# EAGLE schematic atmega_midi_SP0256-AL2 (EAGLE 7.6.0)
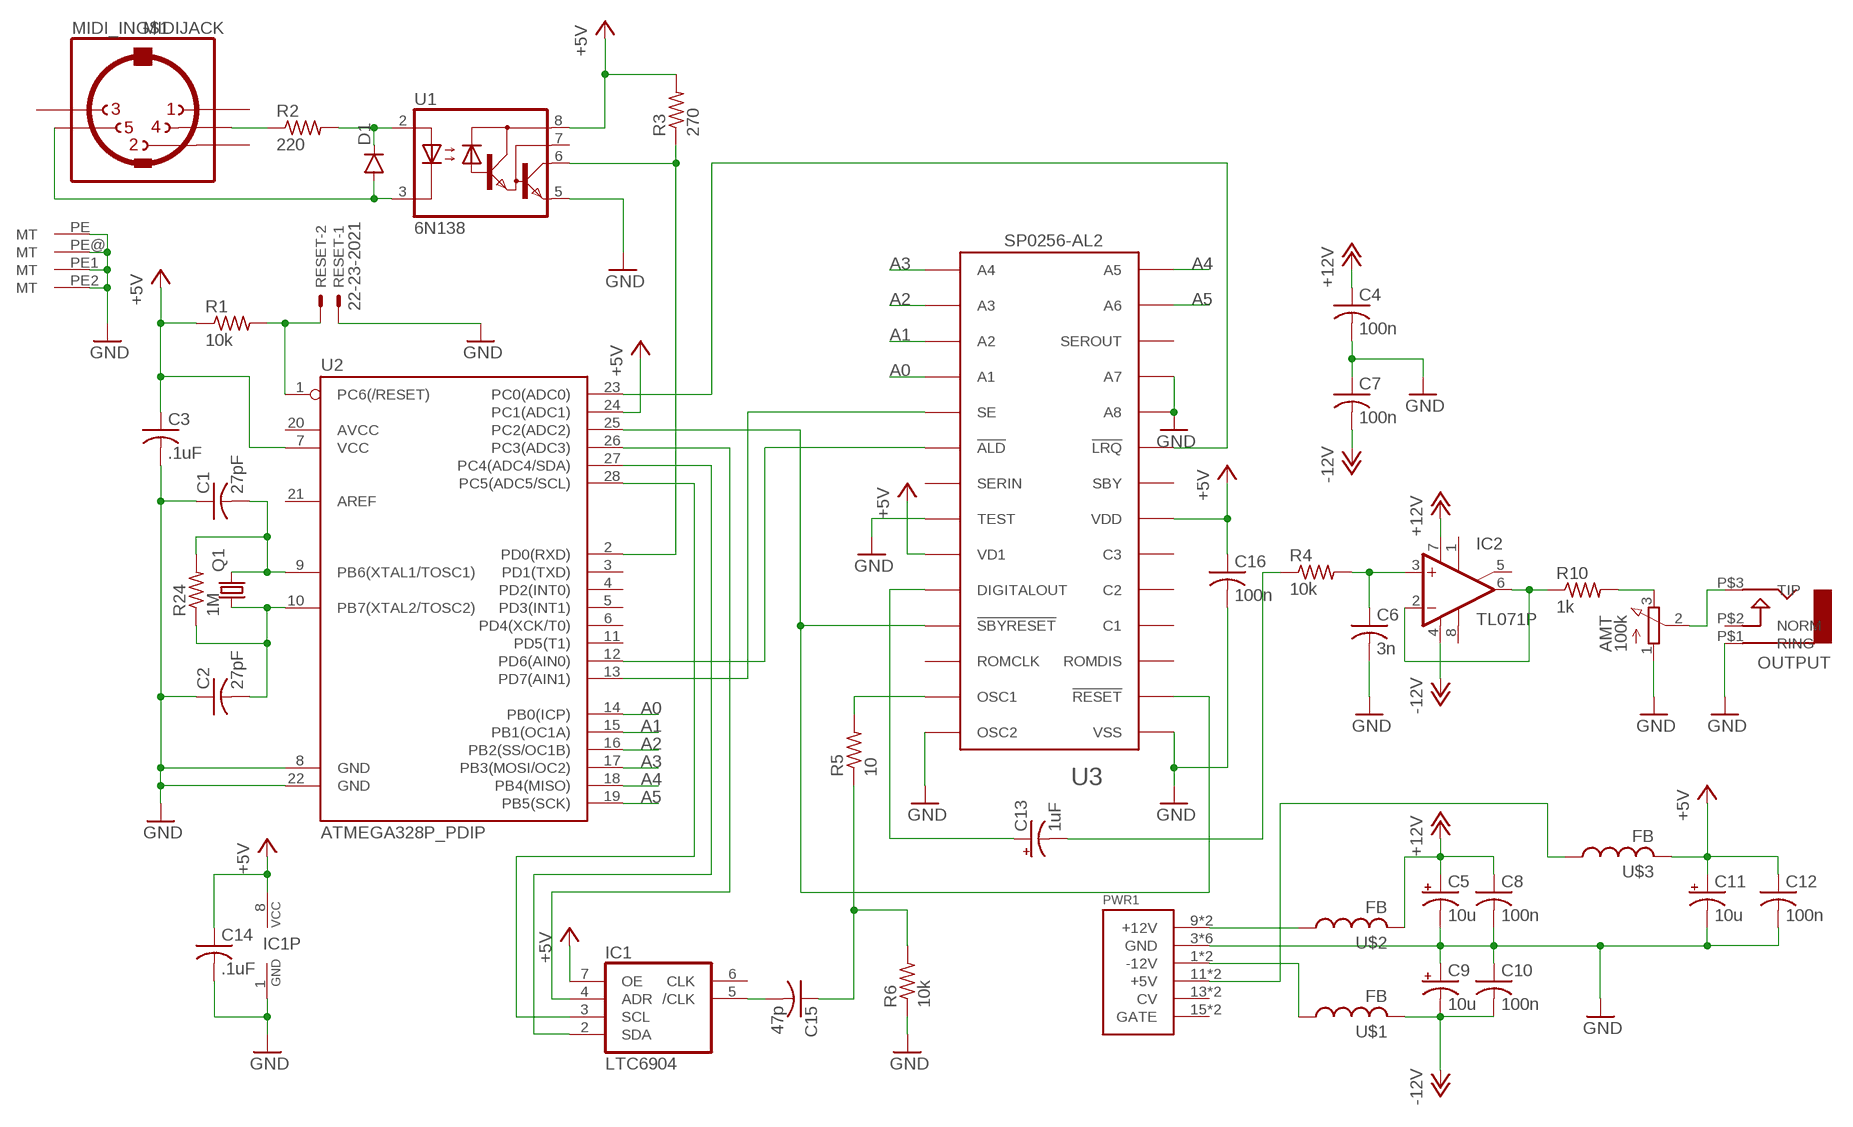
[diagram p0: schematic, sheet 1]

## Parts
AMT  100k  3RP/1610N  [3RP/1610N]
C1  27pF  C-US025-040X050  [C025-040X050]
C2  27pF  C-US025-040X050  [C025-040X050]
C3  .1uF  C-US025-030X050  [C025-030X050]
C4  100n  C-US050-024X044  [C050-024X044]
C5  10u  CPOL-USB45181A  [B45181A]
C6  3n  C-US050-024X044  [C050-024X044]
C7  100n  C-US025-030X050  [C025-030X050]
C8  100n  C-US025-030X050  [C025-030X050]
C9  10u  CPOL-USB45181A  [B45181A]
C10  100n  C-US025-030X050  [C025-030X050]
C11  10u  CPOL-USB45181A  [B45181A]
C12  100n  C-US025-030X050  [C025-030X050]
C13  1uF  CPOL-USE15-6AXIAL  [E15-6]
C14  .1uF  C-US025-030X050  [C025-030X050]
C15  47p  C-US050-024X044  [C050-024X044]
C16  100n  C-US025-030X050  [C025-030X050]
D1  DIODE1N4148  [DIODE-1N4148]
IC1  LTC6904  [DIL08]
IC2  TL071P  [DIL08]
MIDI_IN  MIDIJACK  [CP-2350]
OUTPUT  AUDIO-JACK  [ERTHENVAR-JACK-90DEG]
PWR1  POWER  [POWER_16]
Q1  CRYSTALHC49S  [HC49/S]
R1  10k  R-US_0207/7  [0207/7]
R2  220  R-US_0207/7  [0207/7]
R3  270  R-US_0207/7  [0207/7]
R4  10k  R-US_0207/7  [0207/7]
R5  10  R-US_0207/7  [0207/7]
R6  10k  R-US_0207/7  [0207/7]
R10  1k  R-US_0207/7  [0207/7]
R24  1M  R-US_0207/7  [0207/7]
RESET  22-23-2021  [22-23-2021]
U1  6N138  [DIL08]
U2  ATMEGA328P_PDIP  [DIL28-3]
U3  SP0256-AL2  [DIL28-6]
U$1  FB  [FB]
U$2  FB  [FB]
U$3  FB  [FB]

## Nets
+5V: C3.1 C11.+ C12.1 C14.1 C16.1 IC1.7(OE) IC1.8(VCC) R1.1 R3.2 U1.8(VCC) U2.7(VCC) U2.24(PC1(ADC1)) U3.P$7(VDD) U3.P$23(VD1) U$3.P$2
+12V: C4.1 C5.+ C8.1 IC2.7(V+) U$2.P$2
-12V: C7.2 C9.- C10.2 IC2.4(V-) U$1.P$2
A0: U2.14(PB0(ICP)) U3.P$18(A1)
A1: U2.15(PB1(OC1A)) U3.P$17(A2)
A2: U2.16(PB2(SS/OC1B)) U3.P$16(A3)
A3: U2.17(PB3(MOSI/OC2)) U3.P$15(A4)
A4: U2.18(PB4(MISO)) U3.P$14(A5)
A5: U2.19(PB5(SCK)) U3.P$13(A6)
GND: AMT.1(A) C1.1 C2.1 C3.2 C4.2 C5.- C6.2 C7.1 C8.2 C9.+ C10.1 C11.- C12.2 C14.2 C16.2 IC1.1(GND) MIDI_IN.PE1(MT) MIDI_IN.PE2(MT) MIDI_IN.PE(MT) MIDI_IN.PE@(MT) OUTPUT.P$1(RING) PWR1.3(GND) PWR1.4(GND) PWR1.5(GND) PWR1.6(GND) PWR1.7(GND) PWR1.8(GND) R6.1 RESET.1 U1.5(GND) U2.8(GND) U2.22(GND) U3.P$1(VSS) U3.P$10(A8) U3.P$11(A7) U3.P$22(TEST) U3.P$28(OSC2)
N$1: U2.25(PC2(ADC2)) U3.P$2(!RESET) U3.P$25(!SBYRESET)
N$2: PWR1.11(+5V) PWR1.12(+5V) U$3.P$1
N$3: D1.A MIDI_IN.5 U1.3(C)
N$4: C1.2 Q1.2 R24.2 U2.9(PB6(XTAL1/TOSC1))
N$5: C2.2 Q1.1 R24.1 U2.10(PB7(XTAL2/TOSC2))
N$6: C6.1 IC2.3(+IN) R4.2
N$7: D1.C R2.2 U1.2(A)
N$8: MIDI_IN.4 R2.1
N$9: AMT.3(E) R10.2
N$10: U2.12(PD6(AIN0)) U3.P$20(!ALD)
N$11: PWR1.9(+12V) PWR1.10(+12V) U$2.P$1
N$12: IC2.2(-IN) IC2.6(OUT) R10.1
N$13: AMT.2(S) OUTPUT.P$3(TIP)
N$14: PWR1.1(-12V) PWR1.2(-12V) U$1.P$1
N$15: IC1.3(SCL) U2.28(PC5(ADC5/SCL))
N$16: U2.13(PD7(AIN1)) U3.P$19(SE)
N$17: C13.+ U3.P$24(DIGITALOUT)
N$18: IC1.2(SDA) U2.27(PC4(ADC4/SDA))
N$19: IC1.4(ADR) U2.26(PC3(ADC3))
N$28: U2.23(PC0(ADC0)) U3.P$9(!LRQ)
N$29: C15.2 IC1.5(/CLK)
N$30: R3.1 U1.6(VO) U2.2(PD0(RXD))
N$32: C13.- R4.1
N$33: R5.2 U3.P$27(OSC1)
N$39: C15.1 R5.1 R6.2
N$43: R1.2 RESET.2 U2.1(PC6(/RESET))
Unconnected: IC1.6(CLK) IC2.1(ON1) IC2.5(ON2) IC2.8(OPT) MIDI_IN.1 MIDI_IN.2 MIDI_IN.3 OUTPUT.P$2(NORM) PWR1.13(CV) PWR1.14(CV) PWR1.15(GATE) PWR1.16(GATE) U1.7(VB) U2.3(PD1(TXD)) U2.4(PD2(INT0)) U2.5(PD3(INT1)) U2.6(PD4(XCK/T0)) U2.11(PD5(T1)) U2.20(AVCC) U2.21(AREF) U3.P$3(ROMDIS) U3.P$4(C1) U3.P$5(C2) U3.P$6(C3) U3.P$8(SBY) U3.P$12(SEROUT) U3.P$21(SERIN) U3.P$26(ROMCLK)

## Library data of the parts
AMT = pot:3RP/1610N: 16mm Potentiometer one level Source: http://www.alphapotentiometers.net/html/16mm_pot_2.html
C1-C4 C6-C8 C10 C12 C14-C16 = rcl:C-US: CAPACITOR, American symbol
C5 C9 C11 C13 = rcl:CPOL-US: POLARIZED CAPACITOR, American symbol
D1 = SparkFun-DiscreteSemi:DIODE: Diode These are standard reverse protection diodes and small signal diodes. SMA package can handle up to about 1A. SOD-323 can handle about 200mA. What the SOD-323 package when ordering, there are some mfgs out there that are 5-pin packages.
IC1 = linear-technology-3:LTC6904*: 1kHz - 68MHz Serial Port Programmable Oscillator I²C Interface
IC2 = linear:TL071: OP AMP
MIDI_IN = adafruit:MIDIJACK: DIN 5 jack also known as MIDI jack A modification of conn-hirshman:MAB5SH with two options for the grounding 'teeth'
OUTPUT = erthenvar:AUDIO-JACK: Switching Mono 3.5mm Audio Jack from Erthenvar.
PWR1 = eurorack:POWER
Q1 = crystal:CRYSTAL: CRYSTAL; OC_FARNELL: 1667008; OC_NEWARK: unknown
R1-R6 R10 R24 = rcl:R-US_: RESISTOR, American symbol
RESET = con-molex:22-23-2021: .100" (2.54mm) Center Header - 2 Pin; MF: MOLEX; MPN: 22-23-2021; OC_FARNELL: 1462926; OC_NEWARK: 25C3832
U1 = optocoupler:6N138: MOTOROLA OPTO COUPLER; MF: VISHAY/TELEFUNKEN; MPN: 6N138; OC_FARNELL: 9860150; OC_NEWARK: 35K5294
U2 = SparkFun-DigitalIC:ATMEGA328P_PDIP: uC used in the Arduino 32kb flash, 1k EEPROM, 2k SRAM This is the through-hole version of this chip.
U3 = speech:SP0256-AL2: General Instruments SP0256-AL2 vintage speech synthesizer IC
U$1-U$3 = adafruit:FB: Ferrite bead Digikey #P9821BK-ND

## Net classes
1 GND: width 1.016 mm, drill 1.016 mm, clearance 0.508 mm